# EAGLE design Single_Item_Sensor (EAGLE 8.6.0)
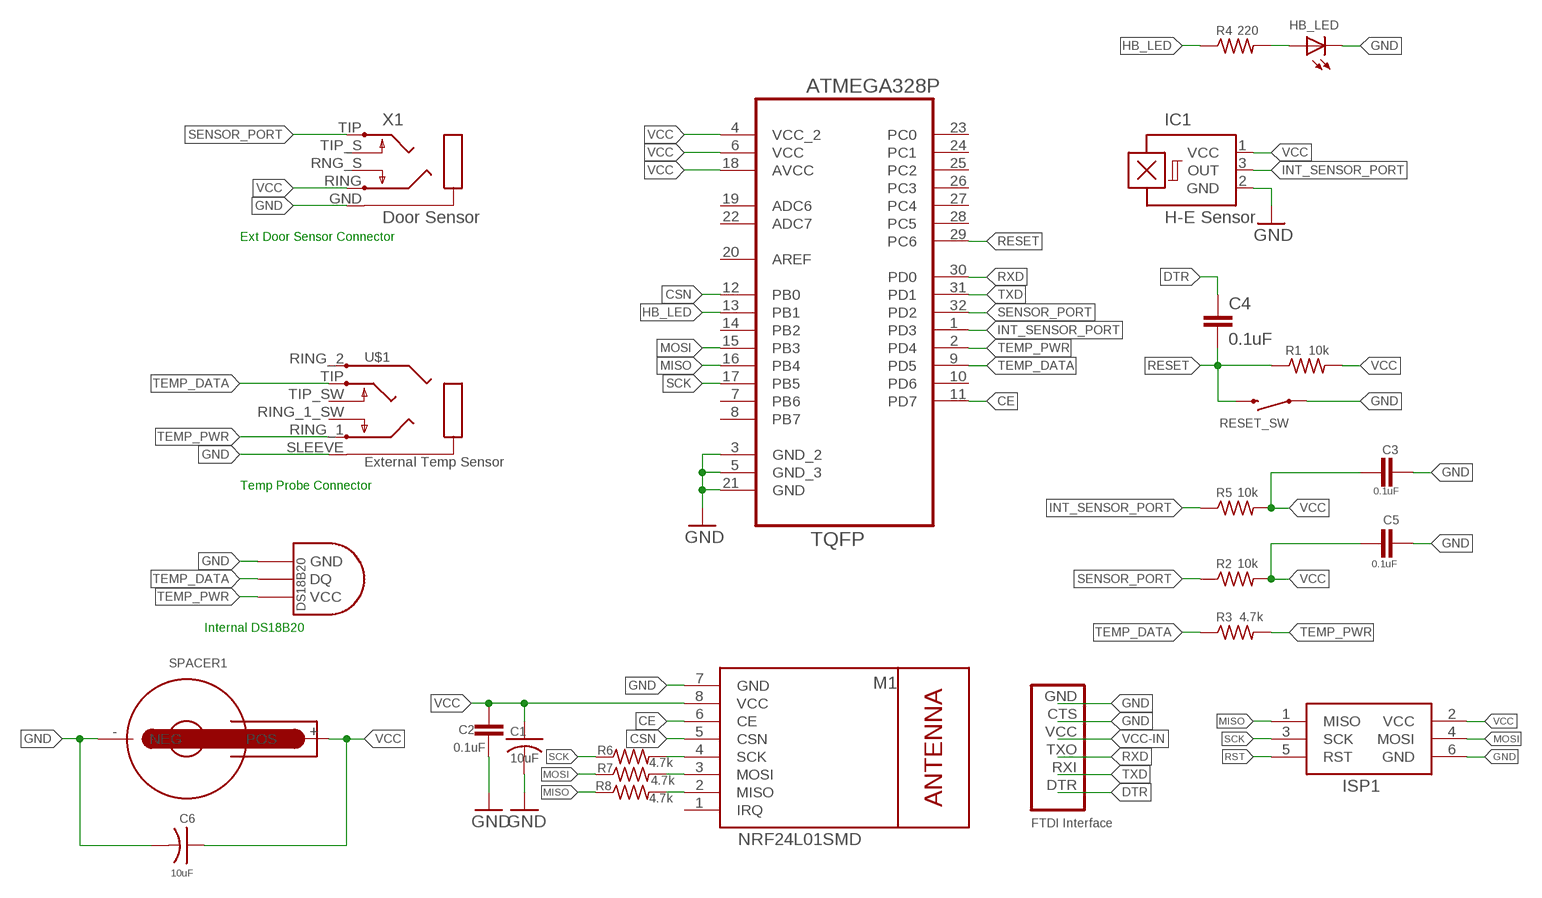
[diagram p0: schematic, sheet 1]

## Parts
C1  10uF  C-USC1206  [C1206]
C2  0.1uF  CAP0805  [0805]
C3  0.1uF  CAP0805  [0805]
C4  0.1uF  CAP0805  [0805]
C5  0.1uF  CAP0805  [0805]
C6  10uF  C-USC1206  [C1206]
HB_LED  LEDCHIP-LED0603  [CHIP-LED0603]
IC1  H-E Sensor  A1202UA  [SIP3-UA]
ISP1  AVRISP-6  [AVRISP]
M1  NRF24L01SMD  WIRELESS-NRF24L01SMD  [WIRELESS-NRF24L01-SMD]
R1  10k  R-US_M0805  [M0805]
R2  10k  R-US_M0805  [M0805]
R3  4.7k  R-US_M0805  [M0805]
R4  220  R-US_M0805  [M0805]
R5  10k  R-US_M0805  [M0805]
R6  4.7k  R-US_M0805  [M0805]
R7  4.7k  R-US_M0805  [M0805]
R8  4.7k  R-US_M0805  [M0805]
RESET_SW  Reset  SWITCH-MOMENTARY-2-SMD-1101NE  [TACTILE-SWITCH-1101NE]
SPACER1  WA-BCPH_SMT_79527141  [79527141]
U1  ATMEGA328P-AU  [QFP80P900X900X120-32N]
U$1  External Temp Sensor  PJ-242  [PJ-242]
U$2  DS1820TO92  [DS1820]
U$3  FTDI Interface  FTDI-HEADER  [1X6-FTDI]
X1  Door Sensor  PG203JPJ-328  [PG203J]

## Nets
CE: M1.6(CE) U1.11(PD7)
CSN: M1.5(CSN) U1.12(PB0)
DTR: C4.1 U$3.DTR
GND: C1.2 C2.2 C3.2 C5.2 C6.2 HB_LED.C IC1.2(GND) ISP1.6(GND) M1.7(GND) RESET_SW.P$1 SPACER1.-(NEG) U1.3(GND_2) U1.5(GND_3) U1.21(GND) U$1.SLEEVE U$2.GND U$3.CTS U$3.GND X1.GND
HB_LED: R4.1 U1.13(PB1)
INT_SENSOR_PORT: IC1.3(OUT) R5.1 U1.1(PD3)
LED+: HB_LED.A R4.2
MISO: ISP1.1(MISO) R8.1 U1.16(PB4)
MOSI: ISP1.4(MOSI) R7.1 U1.15(PB3)
N$1: M1.4(SCK) R6.2
N$2: M1.3(MOSI) R7.2
N$3: M1.2(MISO) R8.2
RESET: C4.2 R1.1 RESET_SW.P$2 U1.29(PC6)
RST: ISP1.5(RST)
RXD: U1.30(PD0) U$3.TXO
SCK: ISP1.3(SCK) R6.1 U1.17(PB5)
SENSOR_PORT: R2.1 U1.32(PD2) X1.TIP
TEMP_DATA: R3.1 U1.9(PD5) U$1.TIP U$2.DQ
TEMP_PWR: R3.2 U1.2(PD4) U$1.RING_1 U$2.VDD(VCC)
TXD: U1.31(PD1) U$3.RXI
VCC: C1.1 C2.1 C3.1 C5.1 C6.1 IC1.1(VCC) ISP1.2(VCC) M1.8(VCC) R1.2 R2.2 R5.2 SPACER1.+(POS) U1.4(VCC_2) U1.6(VCC) U1.18(AVCC) X1.RING
VCC-IN: U$3.VCC
Unconnected: M1.1(IRQ) U1.7(PB6) U1.8(PB7) U1.10(PD6) U1.14(PB2) U1.19(ADC6) U1.20(AREF) U1.22(ADC7) U1.23(PC0) U1.24(PC1) U1.25(PC2) U1.26(PC3) U1.27(PC4) U1.28(PC5) U$1.RING_1_SW U$1.RING_2 U$1.TIP_SW X1.RNG_S X1.TIP_S

## Notes on the sheet
- Ext Door Sensor Connector
- Temp Probe Connector
- Internal DS18B20

## Library data of the parts
C1 C6 = adafruit:C-US: CAPACITOR, American symbol
C2-C5 = GDOv5 Board:CAP: Capacitor Standard 0603 ceramic capacitor, and 0.1" leaded capacitor.
HB_LED = GDOv5 Board:LED: LED OSRAM: - CHIPLED LG R971, LG N971, LY N971, LG Q971, LY Q971, LO R971, LY R971 LH N974, LH R974 LS Q976, LO Q976, LY Q976 LO Q996 - Hyper CHIPLED LW Q18S LB Q993, LB Q99A, LB R99A - SideLED LS A670, LO A670, LY A670, LG A670, LP A670 LB A673, LV A673, LT A673, LW A673 LH A674 LY A675 LS A676, LA A676, LO A676, LY A676, LW A676 LS A679, LY A679, LG A679 - Hyper Micro SIDELED® LS Y876, LA Y876, LO Y876, LY Y876 LT Y87S - SmartLED LW L88C, LW L88S LB L89C, LB L89S, LG L890 LS L89K, LO L89K, LY L89K LS L896, LA L896, LO L896, LY L896 - TOPLED LS T670, LO T670, LY T670, LG T670, LP T670 LSG T670, LSP T670, LSY T670, LOP T670, LYG T670 LG T671, LOG T671, LSG T671 LB T673, LV T673, LT T673, LW T673 LH T674 LS T676, LA T676, LO T676, LY T676, LB T676, LH T676, LSB T676, LW T676 LB T67C, LV T67C, LT T67C, LS T67K, LO T67K, LY T67K, LW E67C LS E67B, LA E67B, LO E67B, LY E67B, LB E67C, LV E67C, LT E67C LW T67C LS T679, LY T679, LG T679 LS T770, LO T770, LY T770, LG T770, LP T770 LB T773, LV T773, LT T773, LW T773 LH T774 LS E675, LA E675, LY E675, LS T675 LS T776, LA T776, LO T776, LY T776, LB T776 LHGB T686 LT T68C, LB T68C - Hyper Mini TOPLED® LB M676 - Mini TOPLED Santana® LG M470 LS M47K, LO M47K, LY M47K Source: http://www.osram.convergy.de/
IC1 = allegro:A12*?: Hall-effect bipolar switch Source: http://www.allegromicro.com/en/Products/Part_Numbers/1202/1202.pdf; OC_FARNELL: unknown; OC_NEWARK: unknown
ISP1 = adafruit:AVRISP: AVR ISP HEADER Standard 6 pin header for AVR programming
M1 = nrf24l01plus:WIRELESS-NRF24L01: 2.4 GHz Wireless Module based on NRF24L01 chip
R1-R8 = adafruit:R-US_: RESISTOR, American symbol
RESET_SW = GDOv5 Board:SWITCH-MOMENTARY-2: Various NO switches- pushbuttons, reed, etc
SPACER1 = EAGLE-BATTERY_HOLDERS-rev16b:WA-BCPH: Battery Holder WA-BCPH Characteristics Flammability rating UL94-V0 Material is Phosphor Bronze Comliance:Lead free and RoHs Packaging unit is 500 <http://katalog.we-online.de/media/images/v2/Battery_Holder_group.jpg> Details see: http://katalog.we-online.de/en/em/BCPH_BATTERY_HOLDER/79527141 2015 (C) Wurth Elektronik
U1 = Ava:ATMEGA328P-AU; DESCRIPTION: 8-bit Microcontroller with In-System Programmable Flash; MPN: ATMEGA328P-AU; OC_FARNELL: 1715486; OC_NEWARK: 14R4631; PACKAGE: TQFP-32; SUPPLIER: Atmel
U$1 = GDOv5 Board:PJ-242: 2.5mm TRRS minijack with switches on T1/R1
U$2 = Ava:DS1820: DS18B20 Programmable Resolution 1-Wire Digital Thermometer Description The DS18B20 digital thermometer provides 9-bit to 12-bit Celsius temperature measurements and has an alarm function with nonvolatile user-programmable upper and lower trigger points. The DS18B20 communicates over a 1-Wire® bus that by definition requires only one data line (and ground) for communication with a central microprocessor. It has an operating temperature range of -55°C to +125°C and is accurate to ±0.5°C over the range of -10°C to +85°C. In addition, the DS18B20 can derive power directly from the data line ("parasite power"), eliminating the need for an external power supply. Each DS18B20 has a unique 64-bit serial code, which allows multiple DS18B20s to function on the same 1-Wire bus. Thus, it is simple to use one microprocessor to control many DS18B20s distributed over a large area. Applications that can benefit from this feature include HVAC environmental controls, temperature monitoring systems inside buildings, equipment, or machinery, and process monitoring and control systems.
U$3 = GDOv5 Board:FTDI-HEADER
X1 = GDOv5 Board:PG203J: 3.5mm Mic/Headphone Jack Stereo microphone/headphone jack PJ-328

## Board
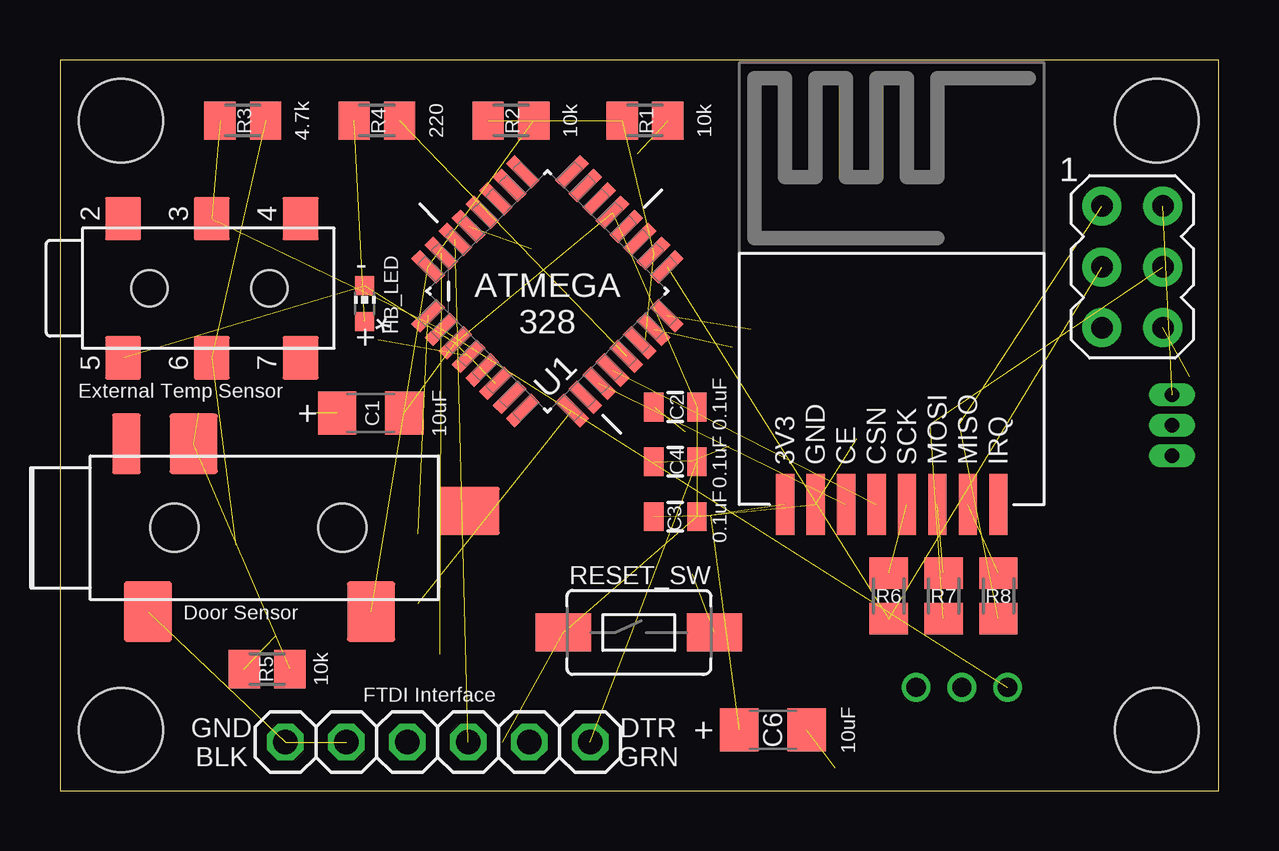
[diagram p1: board, top side]
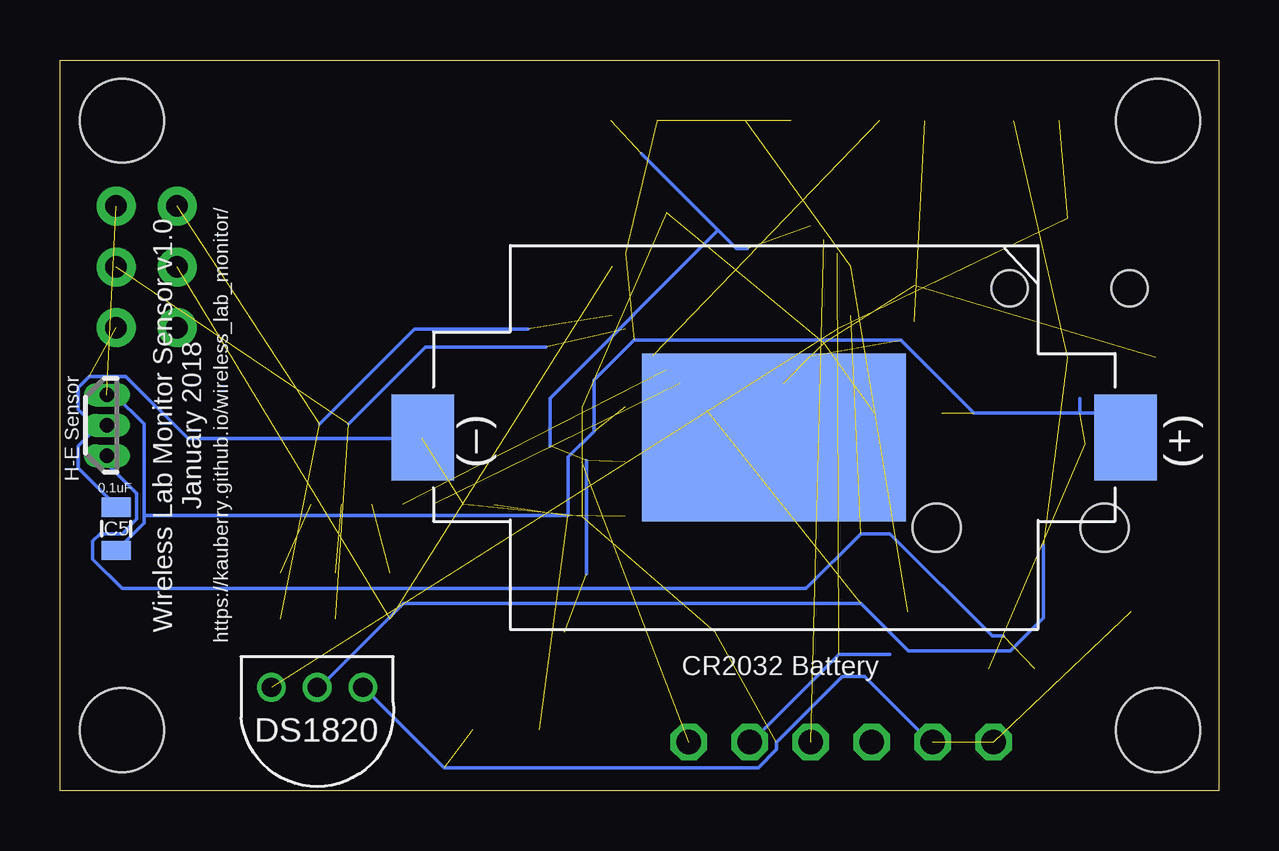
[diagram p2: board, bottom side, seen from below]

Size 48.31 x 30.47 mm. Coordinates in mm from the lower left corner, seen from the top.
Outline: 0,0 48.31,0 48.31,30.47 0,30.47 0,0
Copper layers (1*16): Top 0.0356mm / dielectric 1.5011mm / Bottom 0.0356mm
Design rules "oshpark-2layer *": minimum track width 6mil, minimum drill 13mil, track to track 6mil, track to pad 6mil, pad to pad 6mil, via to via 6mil, smd to smd 6mil, copper to edge 15mil, drill to drill 6mil, minimum pad ring 7mil, minimum via ring 7mil, stop-mask expansion 2.5mil, vias tented up to drill 0mil, thermal gap 10mil
Holes 3.5 mm at 2.54,27.94 45.72,27.94 2.54,2.54 45.72,2.54
tKeepout: area 31.1,21.8 to 31.2,29.7
tRestrict: area 27.9,21.8 to 41.4,30.5
bRestrict: area 30.5,21.6 to 48.3,30.5; area 43.2,0 to 48.3,5.1; area 0,0 to 5.1,5.1; area 0,25.4 to 5.1,30.5

### Footprints (pad centres in the part's own frame; a part is rotated, then mirrored left to right if it is on the bottom)
C1206 = smd 1.6 x 1.8: 1 -1.4,0; 2 1.4,0
0805 = smd 0.8 x 1.2: 1 -0.9,0; 2 0.9,0
CHIP-LED0603 = smd 0.8 x 0.8: A 0,-0.75; C 0,0.75
SIP3-UA = drill 0.6 pad 0.7 long: 1 -1.27,0; 2 0,0; 3 1.27,0
AVRISP = drill 0.9 pad 1.626: 1 -1.27,2.54; 2 1.27,2.54; 3 -1.27,0; 4 1.27,0; 5 -1.27,-2.54; 6 1.27,-2.54
WIRELESS-NRF24L01-SMD = smd 2.54 x 0.762: 1 1.27,0; 2 1.27,1.27; 3 1.27,2.54; 4 1.27,3.81; 5 1.27,5.08; 6 1.27,6.35; 7 1.27,7.62; 8 1.27,8.89
M0805 = smd 1.3 x 1.6: 1 -0.95,0; 2 0.95,0
TACTILE-SWITCH-1101NE = smd 2.3 x 1.6: P$1 -3.15,0; P$2 3.15,0
79527141 = smd 2.6 x 3.6: + 14.65,0; - -14.65,0 | smd 11 x 7: PS1 0,0
QFP80P900X900X120-32N = smd 1.473 x 0.508: 1 -4.242,2.794; 2 -4.242,2.007; 3 -4.242,1.194; 4 -4.242,0.406; 5 -4.242,-0.406; 6 -4.242,-1.194; 7 -4.242,-2.007; 8 -4.242,-2.794; 17 4.242,-2.794; 18 4.242,-2.007; 19 4.242,-1.194; 20 4.242,-0.406; 21 4.242,0.406; 22 4.242,1.194; 23 4.242,2.007; 24 4.242,2.794 | smd 0.508 x 1.473: 9 -2.794,-4.242; 10 -2.007,-4.242; 11 -1.194,-4.242; 12 -0.406,-4.242; 13 0.406,-4.242; 14 1.194,-4.242; 15 2.007,-4.242; 16 2.794,-4.242; 25 2.794,4.242; 26 2.007,4.242; 27 1.194,4.242; 28 0.406,4.242; 29 -0.406,4.242; 30 -1.194,4.242; 31 -2.007,4.242; 32 -2.794,4.242
PJ-242 = smd 1.5 x 1.8: RING_1 -5.1,2.9; RING_1_SW -1.4,2.9; RING_2 -8.8,2.9; SLEEVE -8.8,-2.9; TIP -5.1,-2.9; TIP_SW -1.4,-2.9 | hole 1.5: -7.7,0; -2.7,0
DS1820 = drill 0.8: DQ 2.54,-1.27; GND 0.635,-1.27; VDD 4.445,-1.27
1X6-FTDI = drill 1.016 octagon: CTS 3.81,0; DTR -6.35,0; GND 6.35,0; RXI -3.81,0; TXO -1.27,0; VCC 1.27,0
PG203J = smd 2 x 2.5: GND 2.4,-6.5; RING 4.3,0.5; TIP 11.7,-6.5 | smd 1.2 x 2.5: RNG_S 1.5,0.5 | smd 2.5 x 2: TIP_S 15.8,-2.3 | hole 2: 3.5,-3; 10.5,-3

### Placement (x,y rotation side)
C1  12.95,15.75 0 top
C2  25.65,16 0 top
C3  25.65,11.43 0 top
C4  25.65,13.72 180 top
C5  45.96,10.92 90 bottom
C6  29.72,2.54 0 top
HB_LED  12.7,20.32 0 top
IC1  46.35,15.24 270 bottom
ISP1  44.7,21.84 0 top
M1  39.12,10.67 90 top
R1  24.38,27.94 180 top
R2  18.8,27.94 180 top
R3  7.62,27.94 180 top
R4  13.21,27.94 180 top
R5  8.64,5.08 0 top
R6  34.54,8.13 90 top
R7  36.83,8.13 90 top
R8  39.12,8.13 90 top
RESET_SW  24.13,6.6 0 top
SPACER1  18.54,14.73 0 bottom
U1  20.32,20.83 45 top
U$1  11.43,20.95 0 top
U$2  35.05,3.05 180 bottom
U$3  15.75,2.03 180 top
X1  1.27,13.97 0 top

### Tracks (layer width: path | path; a pad name or v marks a point on that pad's centre or on a via)
CE  (1 unrouted)
CSN  (1 unrouted)
DTR  (1 unrouted)
GND  (15 unrouted)
  Bottom 0.152: U$3.CTS 12.04,2.03 14.78,4.78 15.7,4.78 18.44,2.03 18.44,1.73 19.2,0.97 32.31,0.97 35.66,4.32 U$2.GND | 46.79,15.14 47.55,14.38 47.55,13.46 46.02,11.94 C5.2 | 46.79,15.14 46.48,15.14 IC1.2 46.79,15.14 | 46.79,15.14 47.55,15.9 47.55,16.81 47.09,17.27 45.57,17.27 42.98,14.68 33.22,14.68 SPACER1.-
HB_LED  (1 unrouted)
INT_SENSOR_PORT  (2 unrouted)
  Bottom 0.152: 8.99,6.45 9.45,6.45 13.72,10.72 14.94,10.72 17.22,8.43 45.72,8.43 46.94,9.65 46.94,10.41 46.63,10.72 45.72,10.72 45.11,11.33 45.11,12.4 46.33,13.61 46.33,13.92 IC1.3
LED+  (1 unrouted)
MISO  (3 unrouted)
  Bottom 0.152: 28.8,19.25 33.53,19.25 37.49,15.29
MOSI  (3 unrouted)
  Bottom 0.152: 28.04,18.49 33.07,18.49 36.27,15.29
N$1  (1 unrouted)
N$2  (1 unrouted)
N$3  (1 unrouted)
RESET  (5 unrouted)
  Bottom 0.152: 26.36,9.04 26.36,13.77 | 19.66,22.61 20.12,22.61 20.88,23.37 | 24.08,26.57 20.88,23.37 | 27.89,14.38 27.89,16.36 20.88,23.37
RXD  (1 unrouted)
SCK  (2 unrouted)
SENSOR_PORT  (2 unrouted)
TEMP_DATA  (3 unrouted)
  Bottom 0.152: U$2.DQ 37.49,4.32 33.98,7.82 14.94,7.82 12.95,5.84 8.69,5.84 7.32,7.21 7.32,10.26
TEMP_PWR  (3 unrouted)
TXD  (1 unrouted)
  Bottom 0.152: 13.72,5.69 15.85,5.69 19.51,2.03 U$3.RXI
VCC  (13 unrouted)
  Bottom 0.152: 5.79,15.75 4.88,15.75 3.96,14.83 SPACER1.+ | 5.79,15.75 10.21,15.75 13.26,18.8 24.38,18.8 26.06,17.12 26.06,14.99 27.13,13.92 27.13,11.48 44.81,11.48 | 44.81,11.48 44.81,15.29 46.02,16.51 IC1.1 | 44.81,11.48 44.81,11.18 45.87,10.11 C5.1 | 5.79,15.75 5.79,16.36

### Text on the board
tPlace: ATMEGA / 328
bPlace: https://kauberry.github.io/wireless_lab_monitor/ | Wireless Lab Monitor Sensor v1.0 / January 2018
tNames: - | + | + | 0.1uF | +
bNames: (+) | (–) | CR2032 Battery